# Altium schematic sheet esp_loadcell_schematic.SchDoc
size A3
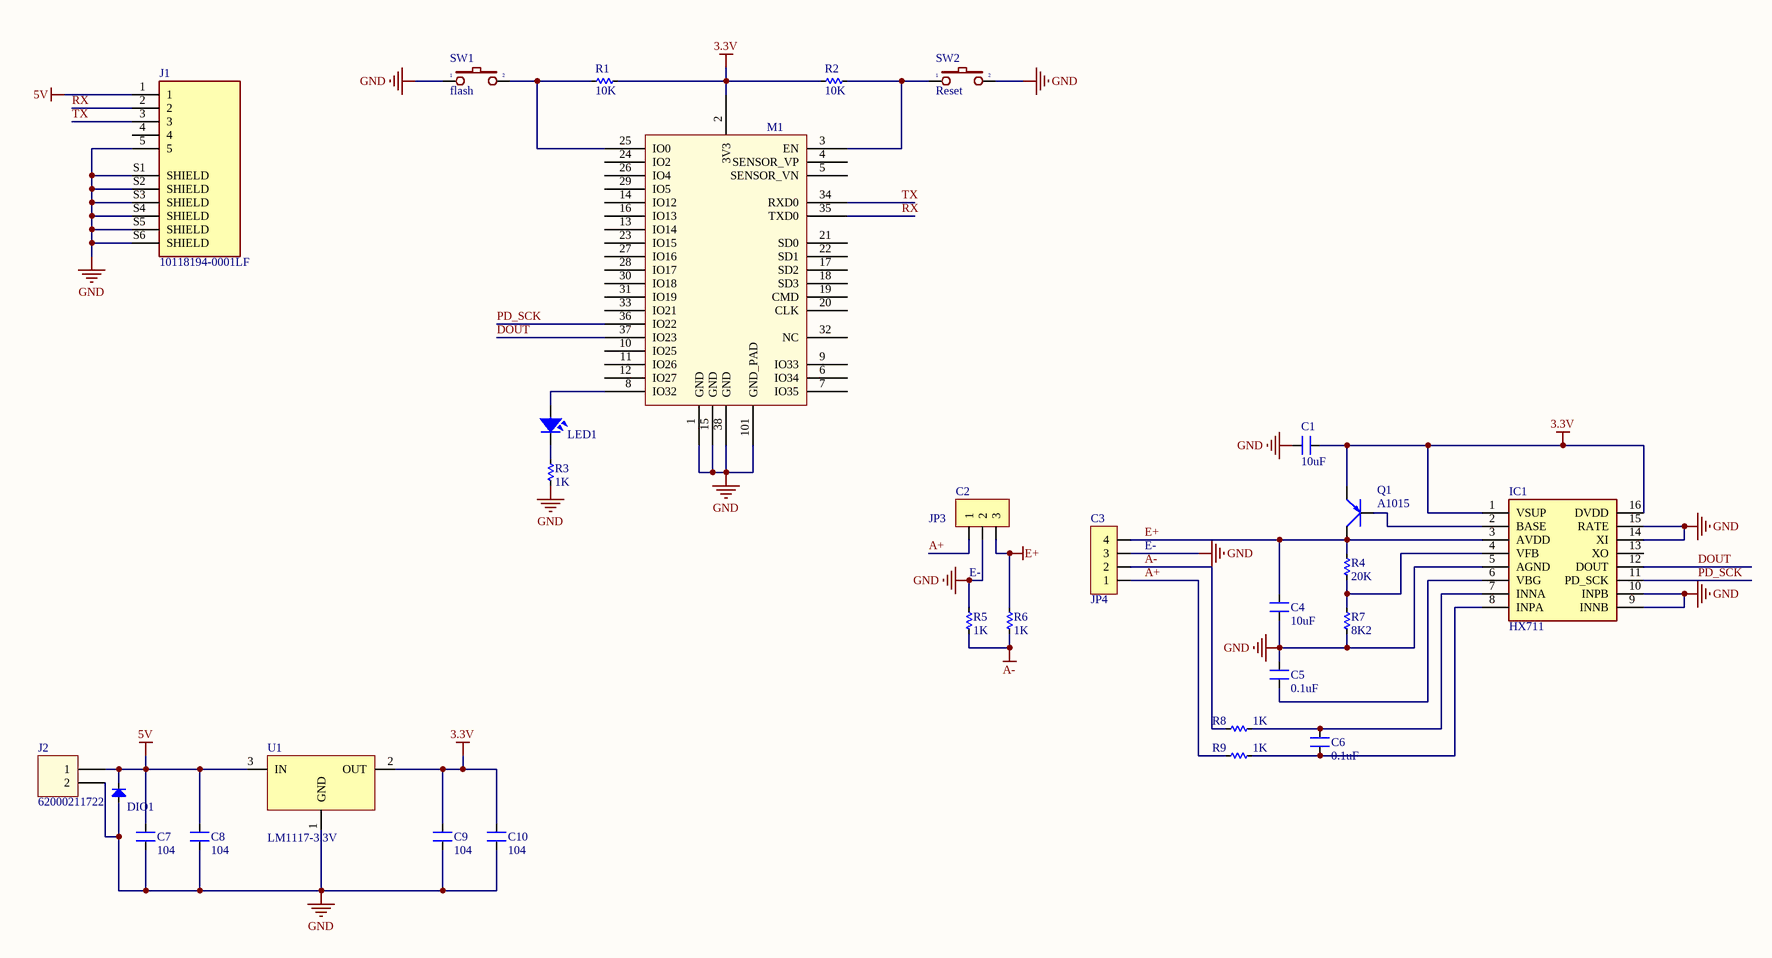
[diagram p0: esp_loadcell_schematic.SchDoc]

## Parts
C1  10uF  [SM-CAP-0805]
C2  JP3  [JP3-D1T]
C3  JP4  [JP4-C1T]
C4  10uF  [SM-CAP-0805]
C5  0.1uF  [SM-CAP-0805]
C6  0.1uF  [SM-CAP-0805]
C7  104  [SM-CAP-0805]
C8  104  [SM-CAP-0805]
C9  104  [SM-CAP-0805]
C10  104  [SM-CAP-0805]
DIO1  Diode SMD  [DIO-SMD-123]  (value not drawn)
IC1  HX711  [SOIC127P600X160-16N]
J1  10118194-0001LF  [AMPHENOL_10118194-0001LF]
J2  62000211722  [62000211722]
LED1  LED  [LED-0805-Blue]  (value not drawn)
M1  ESP32S_Module  [ESP32S]  (value not drawn)
Q1  A1015  [SOT23B]
R1  10K  [RES-SMD-0805]
R2  10K  [RES-SMD-0805]
R3  1K  [RES-SMD-0805]
R4  20K  [RES-SMD-0805]
R5  1K  [RES-SMD-0805]
R6  1K  [RES-SMD-0805]
R7  8K2  [RES-SMD-0805]
R8  1K  [RES-SMD-0805]
R9  1K  [RES-SMD-0805]
SW1  flash  [SW-DIP1-1]
SW2  Reset  [SW1-SMD]
U1  LM1117-3.3V  [SOT223]

## Nets
3.3V: C1.1 C9.2 C10.2 IC1.1(VSUP) IC1.16(DVDD) M1.2(3V3) Q1.1(E) R1.2 R2.1 U1.2(OUT)
5V: C7.2 C8.2 DIO1.2(K) J1.1 J2.1 U1.3(IN)
A-: C3.2 R5.2 R6.2 R8.2
E+: C2.3 C3.4 C4.2 IC1.3(AVDD) Q1.2(C) R4.2 R6.1
GND: C1.2 C2.2 C3.3 C4.1 C5.2 C7.1 C8.1 C9.1 C10.1 DIO1.1(A) IC1.5(AGND) IC1.9(INNB) IC1.10(INPB) IC1.14(XI) IC1.15(RATE) J1.5 J1.S1(SHIELD) J1.S2(SHIELD) J1.S3(SHIELD) J1.S4(SHIELD) J1.S5(SHIELD) J1.S6(SHIELD) J2.2 M1.1(GND) M1.15(GND) M1.38(GND) M1.101(GND_PAD) R3.1 R5.1 R7.1 SW1.1 SW2.2 U1.1(GND)
A+: C2.1 C3.1 R9.2
DOUT: IC1.12(DOUT) M1.37(IO23)
PD_SCK: IC1.11(PD_SCK) M1.36(IO22)
RX: J1.2 M1.35(TXD0)
TX: J1.3 M1.34(RXD0)
NetC5_1: C5.1 IC1.6(VBG)
NetC6_1: C6.1 IC1.8(INPA) R9.1
NetC6_2: C6.2 IC1.7(INNA) R8.1
NetIC1_2: IC1.2(BASE) Q1.3(B)
NetIC1_4: IC1.4(VFB) R4.1 R7.2
NetLED1_1: LED1.1 M1.8(IO32)
NetLED1_2: LED1.2 R3.2
NetM1_3: M1.3(EN) R2.2 SW2.1
NetM1_25: M1.25(IO0) R1.1 SW1.2

Not connected (* = marked no-connect by the designer): IC1 13(XO); J1 4; M1 4(SENSOR_VP) 5(SENSOR_VN) 6(IO34) 7(IO35) 9(IO33) 10(IO25) 11(IO26) 12(IO27) 13(IO14) 14(IO12) 16(IO13) 17(SD2) 18(SD3) 19(CMD) 20(CLK) 21(SD0) 22(SD1) 23(IO15) 24(IO2) 26(IO4) 27(IO16) 28(IO17) 29(IO5) 30(IO18) 31(IO19) 32(NC) 33(IO21)

## Notes on the sheet
- (near C3) E-
- E-

## Library data of the parts
C1 C4-C10 = CN: Value: 0,1uF/300V; Designed by: VanDungEvn
C2 = JP3: WR-PHD 2.54 mm Angled Socket Header; Manufacturer: W¨¹rth Elektronik eiSos GmbH; partNo: 613003143121; ComponentLink1 Description: Manufacturer; ComponentLink2 Description: Datasheet; NoPins: 03; Created Date: 29 March 2013; ComponentLink1URL: http://www.we-online.com; ComponentLink2URL: http://katalog.we-online.de/em/datasheet/6130xx143121.pdf; Created by: Karrer Zheng
C3 = JP4: WR-PHD 2.54 mm Angled Socket Header; Manufacturer: W¨¹rth Elektronik eiSos GmbH; partNo: 613004143121; ComponentLink1 Description: Manufacturer; ComponentLink2 Description: Datasheet; NoPins: 04; Created Date: 29 March 2013; ComponentLink1URL: http://www.we-online.com; ComponentLink2URL: http://katalog.we-online.de/em/datasheet/6130xx143121.pdf; Created by: Karrer Zheng
DIO1 = Diode SMD: Default Diode; Code - JEDEC: DO-214-AB; Value: 1N5007; Published: 8-Jun-2000; Revision: July-2002: Re-released for DXP Platform.; Publisher: Altium Limited
IC1 = HX711: Integrated Circuit; Manufacturer_Name: AVIA Semiconductor; Datasheet Link: https://cdn.sparkfun.com/datasheets/Sensors/ForceFlex/hx711_english.pdf; Height: 1.6mm; Manufacturer_Part_Number: HX711
J1 = 10118194-0001LF: USB - micro B USB 2.0 Receptacle Connector 5 Position Surface Mount, Right Angle; Through Hole; MF: Amphenol ICC; Package: None; Price: None; Availability: Unavailable; MP: 10118194-0001LF; SnapEDA_Link: https://www.snapeda.com/parts/10118194-0001LF/Amphenol%20FCI/view-part/1413308/?ref=snap; Value: *
J2 = 62000211722: WR-WTB 2.00mm Male Horizontal Shrouded Header, 2p; Pin Number: 2; ComponentLink1Description: Manufacturer; ComponentLink1URL: http://www.we-online.de; ComponentLink2Description: Datasheet; ComponentLink2URL: http://katalog.we-online.de/em/datasheet/6200xx11722.pdf; Part Number: 62000211722; Published Date: June 2017; Publisher: Wurth Elektronik; Pitch: 2.00 mm
LED1 = LED SMD: Value: LED 3 - 5 ly 2 Colour
M1 = ESP32S_Module: Esp-32S; Datasheet: https://espressif.com/sites/default/files/documentation/esp_wroom_32_datasheet_en.pdf
Q1 = A1015: PNP 600mW, ECB; Value: A1015
R1-R9 = Res-SMD: Resistor; Manufacturer: Generic Components; Class: Passive; Published: 08/06/2000; Publisher: Altium Hobart Technology Centre
SW1 SW2 = SW2: Switch button 2 pin; Value: SW chip 2 pin
U1 = LM1117: 800mA Low-Dropout Linear Regulator; Creator: Nguyen Ba Bien; Website: http://group3i.net